# Altium schematic sheet REG113-25_sch.SchDoc
size A4; Organization1: VINCULADA AO EXÉRCITO BRASILEIRO; Organization2: FÁBRICA DE MATERIAL DE; Organization3: COMUNICAÇÕES E ELETRÔNICA; Organization0: INDÚSTRIA DE MATERIAL BÉLICO DO BRASIL; Esquematico: Esquemático
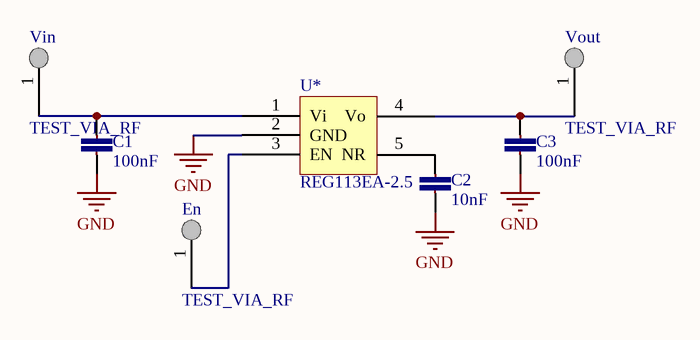
[diagram p0: REG113-25_sch.SchDoc]

## Parts
C1  100nF  [0402-CAP]
C2  10nF  [0402-CAP]
C3  100nF  [0402-CAP]
En  TEST_VIA_RF  [New footprint 1]
U*  REG113EA-2.5  [SOT95P280X145-5N]
Vin  TEST_VIA_RF  [New footprint 1]
Vout  TEST_VIA_RF  [New footprint 1]

## Nets
GND: C1.2 C2.2 C3.2 U*.2(GND)
NetC1_1: C1.1 U*.1(Vi) Vin.1
NetC2_1: C2.1 U*.5(NR)
NetC3_1: C3.1 U*.4(Vo) Vout.1
NetEn_1: En.1 U*.3(EN)

## Notes on the sheet
- USADO EQUIP.:
- DATA:
- ENG:
- VERIF:
- HORA:
- REV:
- APROV:
- TÍTULO:
- FOLHA:
- /
- FORMATO:
- A4
- CÓDIGO:
- ESTOQUE:

## Library data of the parts
C1 C3 = CC0402-100nF-50v-A.4: CAP CER 0.1UF 50V 10% X7R 0402; Part No: C1005X7R1H104K050BB; Cod EMS: 05.281.019.021; Value: 100n
C2 = CC0402-10nF-5: CAP CER 10000PF 25V 5% X7R 0402; Part No: GRM155R71E103JA01J; Cod EMS: 05.281.019.508; Value: 10n
En Vin Vout = TEST_VIA_RF-01.A.1: Test VIA for RF circuits
U* = REG113EA-2.5-01.A.1: IC REG LINEAR 2.5V 400MA 8VSSOP